# Altium project self_custom_etb_driver.PrjPcb
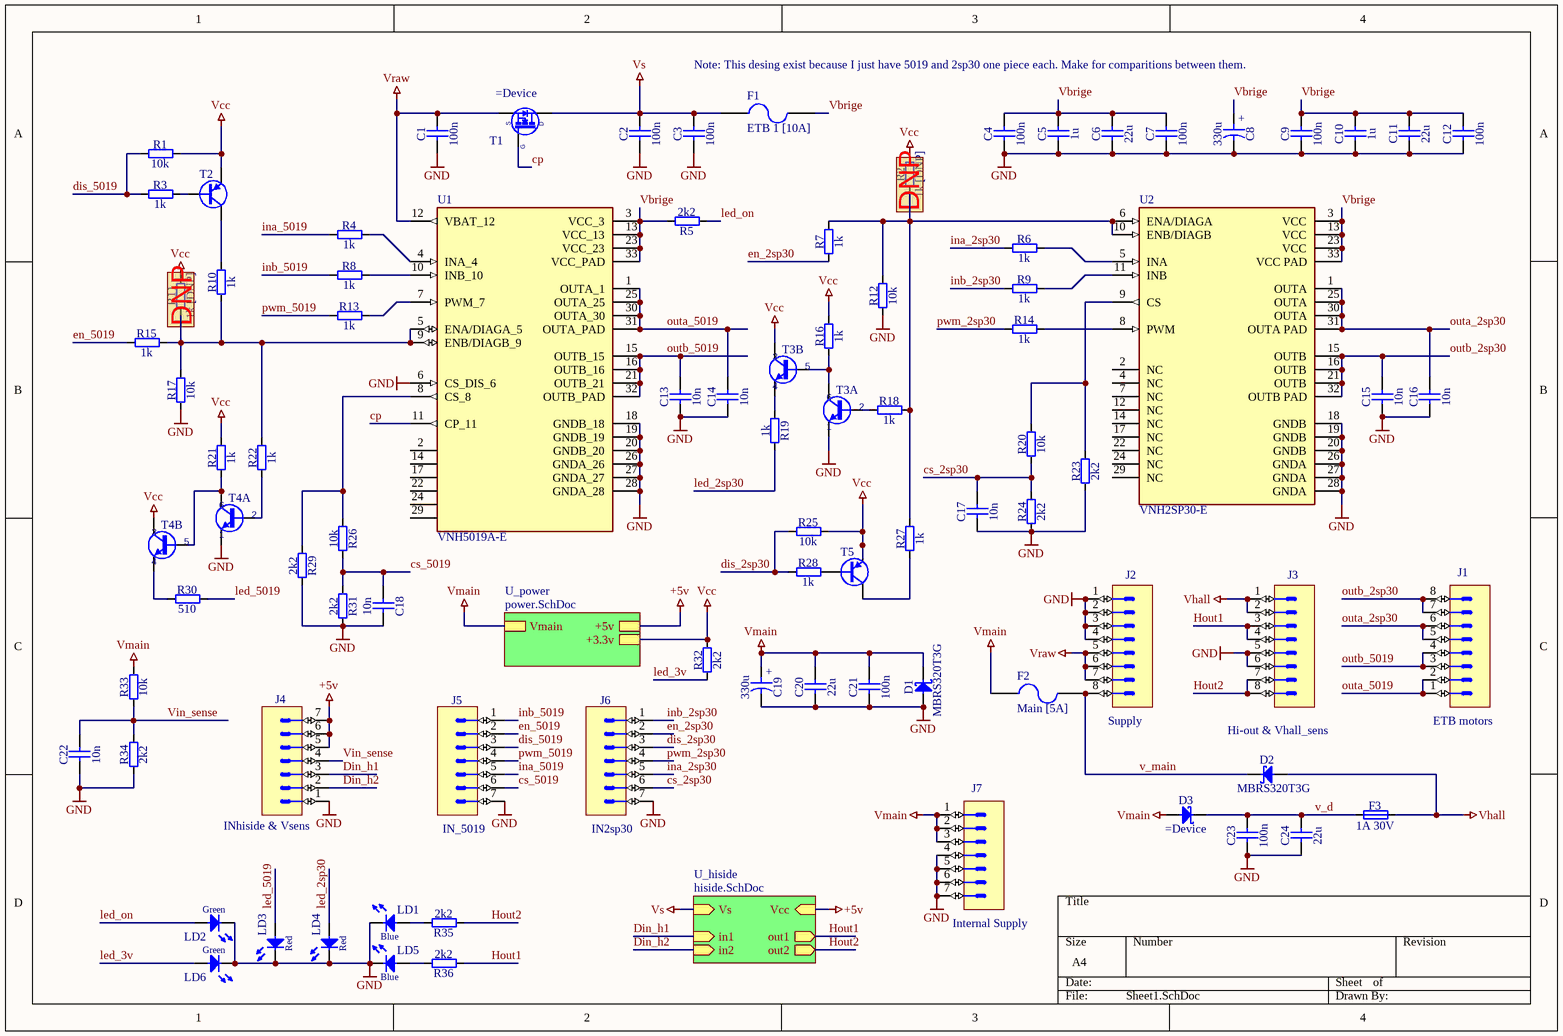
[diagram p0: Sheet1.SchDoc]
3 sheets, 125 parts. Net scope: hierarchical (ports join the sheet entries above them; power ports are global).
Board file: etb_drv.PcbDoc
Sheets:
  Sheet1.SchDoc
    U_power = power.SchDoc
    U_hiside = hiside.SchDoc

## Sheet Sheet1.SchDoc
size A4

### Parts
C1  100n  [CAPC1608X87N]
C2  100n  [CAPC1608X87N]
C3  100n  [CAPC1608X87N]
C4  100n  [CAPC1608X87N]
C5  1u  [CAPC2012X88N]
C6  22u  [CAPC3216X140N]
C7  100n  [CAPC1608X87N]
C8  330u  [CAP AL TH D10 L5 H12.5]
C9  100n  [CAPC1608X87N]
C10  1u  [CAPC2012X88N]
C11  22u  [CAPC3216X140N]
C12  100n  [CAPC1608X87N]
C13  10n  [CAPC1608X87N]
C14  10n  [CAPC1608X87N]
C15  10n  [CAPC1608X87N]
C16  10n  [CAPC1608X87N]
C17  10n  [CAPC1608X87N]
C18  10n  [CAPC1608X87N]
C19  330u  [CAP AL TH D10 L5 H12.5]
C20  22u  [CAPC3216X140N]
C21  100n  [CAPC1608X87N]
C22  10n  [CAPC1608X87N]
C23  100n  [CAPC1608X87N]
C24  22u  [CAPC3216X140N]
D1  MBRS320T3G  [DIOM7659X265N]
D2  MBRS320T3G  [DIOM7659X265N]
D3  (no value)  [SOD123F]
F1  ETB 1 [10A]  [automotive fuse by sd]
F2  Main [5A]  [automotive fuse by sd]
F3  1A 30V  [FUSC_LITTELFUSE_466]
J1  ETB motors  [MOLEX_22-27-2081]
J2  Supply  [MOLEX_22-27-2081]
J3  Hi-out & Vhall_sens  [MOLEX_22-27-2081]
J4  INhiside & Vsens  [MOLEX_22-04-1071]
J5  IN_5019  [MOLEX_22-04-1071]
J6  IN2sp30  [MOLEX_22-04-1071]
J7  Internal Supply  [MOLEX_22-04-1071]
LD1  (no value)  [LED_5MM_YELLOW_1C-2A]
LD2  (no value)  [LED_5MM_GREEN_1C-2A]
LD3  (no value)  [LED_5MM_RED_1C-2A]
LD4  (no value)  [LED_5MM_RED_1C-2A]
LD5  (no value)  [LED_5MM_YELLOW_1C-2A]
LD6  (no value)  [LED_5MM_GREEN_1C-2A]
R1  10k  [RESC1608X55N]
R2  1k [DNP]  [RESC1608X55N]
R3  1k  [RESC1608X55N]
R4  1k  [RESC2013X64N]
R5  2k2  [RESC1608X55N]
R6  1k  [RESC2013X64N]
R7  1k  [RESC1608X55N]
R8  1k  [RESC1608X55N]
R9  1k  [RESC1608X55N]
R10  1k  [RESC1608X55N]
R11  1k [DNP]  [RESC1608X55N]
R12  10k  [RESC1608X55N]
R13  1k  [RESC1608X55N]
R14  1k  [RESC1608X55N]
R15  1k  [RESC1608X55N]
R16  1k  [RESC1608X55N]
R17  10k  [RESC1608X55N]
R18  1k  [RESC1608X55N]
R19  1k  [RESC1608X55N]
R20  10k  [RESC1608X55N]
R21  1k  [RESC1608X55N]
R22  1k  [RESC1608X55N]
R23  2k2  [RESC1608X55N]
R24  2k2  [RESC1608X55N]
R25  10k  [RESC1608X55N]
R26  10k  [RESC1608X55N]
R27  1k  [RESC1608X55N]
R28  1k  [RESC1608X55N]
R29  2k2  [RESC1608X55N]
R30  510  [RESC1608X55N]
R31  2k2  [RESC1608X55N]
R32  2k2  [RESC1608X55N]
R33  10k  [RESC1608X55N]
R34  2k2  [RESC1608X55N]
R35  2k2  [RESC1608X55N]
R36  2k2  [RESC1608X55N]
T1  (no value)  [TO228P991X239-3N-R546X521]
T2  BC857B  [SOT95P230X110-3N]  (value not drawn)
T3  BC847BV  [SOT65P210X110-6N]  (value not drawn)  (parts A,B of 2)
T4  BC847BV  [SOT65P210X110-6N]  (value not drawn)  (parts A,B of 2)
T5  BC857B  [SOT95P230X110-3N]  (value not drawn)
U1  VNH5019A-E  [STMicroelectronics_MultiPowerSO-30_0]
U2  VNH2SP30-E  [STMicroelectronics_MultiPowerSO-30_0]

### Sub-sheets
U_hiside = hiside.SchDoc: in1 (in), in2 (in), out1 (out), out2 (out), Vs (in), Vcc (in)
U_power = power.SchDoc: Vmain, +5v, +3.3v

### Nets
+5v: J4.5 J4.6 J4.7 R1.2 R2.2 R11.2 R16.2 R21.2 R25.2 R32.1 T2.2(E) T3.3(C) T4.3(C) T5.2(E) ; sheet U_power/+5v, sheet U_power/+3.3v, sheet U_hiside/Vcc  [also labelled Vcc]
GND: C1.1 C2.1 C3.1 C4.1 C5.1 C6.1 C7.1 C8.2 C9.1 C10.1 C11.1 C12.1 C13.1 C14.1 C15.1 C16.1 C17.1 C18.1 C19.2 C20.1 C21.1 C22.1 C23.1 C24.1 D1.2(A) J2.1 J2.2 J2.3 J2.4 J3.5 J3.6 J4.1 J5.7 J6.7 J7.4 J7.5 J7.6 J7.7 LD1.1(C) LD2.1(C) LD3.1(C) LD4.1(C) LD5.1(C) LD6.1(C) R12.1 R17.1 R23.1 R24.1 R29.1 R31.1 R34.1 T3.1(E) T4.1(E) U1.6(CS_DIS_6) U1.18(GNDB_18) U1.19(GNDB_19) U1.20(GNDB_20) U1.26(GNDA_26) U1.27(GNDA_27) U1.28(GNDA_28) U2.18(GNDB) U2.19(GNDB) U2.20(GNDB) U2.26(GNDA) U2.27(GNDA) U2.28(GNDA)
Vhall: D2.2(A) F3.2 J3.1 J3.2
Vmain: C19.1 C20.2 C21.2 D1.1(C) D3.2(A) F2.1 J7.1 J7.2 J7.3 R33.2 ; sheet U_power/Vmain
Vraw: C1.2 J2.5 J2.6 J2.7 T1.3(S) U1.12(VBAT_12)
Vs: C2.2 C3.2 F1.2 T1.2(D) ; sheet U_hiside/Vs
cp: T1.1(G) U1.11(CP_11)
cs_2sp30: C17.2 J6.6 R20.1 R24.2
cs_5019: C18.2 J5.6 R26.1 R31.2
Din_h1: J4.3 ; sheet U_hiside/in1
Din_h2: J4.2 ; sheet U_hiside/in2
dis_2sp30: J6.3 R25.1 R28.1
dis_5019: J5.3 R1.1 R3.1
en_2sp30: J6.2 R7.1
en_5019: J5.2 R15.1
Hout1: J3.3 J3.4 R36.2 ; sheet U_hiside/out1
Hout2: J3.7 J3.8 R35.2 ; sheet U_hiside/out2
ina_2sp30: J6.5 R6.1
ina_5019: J5.5 R4.1
inb_2sp30: J6.1 R9.1
inb_5019: J5.1 R8.1
led_2sp30: LD4.2(A) R19.2
led_3v: LD6.2(A) R32.2
led_5019: LD3.2(A) R30.2
led_on: LD2.2(A) R5.2
outa_2sp30: C16.2 J1.5 J1.6 U2.1(OUTA) U2.25(OUTA) U2.30(OUTA) U2.31(OUTA_PAD)
outa_5019: C14.2 J1.1 J1.2 U1.1(OUTA_1) U1.25(OUTA_25) U1.30(OUTA_30) U1.31(OUTA_PAD)
outb_2sp30: C15.2 J1.7 J1.8 U2.15(OUTB) U2.16(OUTB) U2.21(OUTB) U2.32(OUTB_PAD)
outb_5019: C13.2 J1.3 J1.4 U1.15(OUTB_15) U1.16(OUTB_16) U1.21(OUTB_21) U1.32(OUTB_PAD)
pwm_2sp30: J6.4 R14.1
pwm_5019: J5.4 R13.1
v_d: C23.2 C24.2 D3.1(C) F3.1
v_main: D2.1(C) F2.2 J2.8
Vbrige: C4.2 C5.2 C6.2 C7.2 C8.1 C9.2 C10.2 C11.2 C12.2 F1.1 R5.1 U1.3(VCC_3) U1.13(VCC_13) U1.23(VCC_23) U1.33(VCC_PAD) U2.3(VCC) U2.13(VCC) U2.23(VCC) U2.33(VCC_PAD)
Vin_sense: C22.2 J4.4 R33.1 R34.2
NetLD1_2: LD1.2(A) R35.1
NetLD5_2: LD5.2(A) R36.1
NetR2_1: R2.1 R7.2 R12.2 R18.2 R27.2 U2.6(ENA/DIAGA) U2.10(ENB/DIAGB)
NetR3_2: R3.2 T2.1(B)
NetR4_2: R4.2 U1.4(INA_4)
NetR6_2: R6.2 U2.5(INA)
NetR8_2: R8.2 U1.10(INB_10)
NetR9_2: R9.2 U2.11(INB)
NetR10_1: R10.1 R11.1 R15.2 R17.2 R22.2 U1.5(ENA/DIAGA_5) U1.9(ENB/DIAGB_9)
NetR10_2: R10.2 T2.3(C)
NetR13_2: R13.2 U1.7(PWM_7)
NetR14_2: R14.2 U2.8(PWM)
NetR16_1: R16.1 T3.5(B) T3.6(C)
NetR18_1: R18.1 T3.2(B)
NetR19_1: R19.1 T3.4(E)
NetR20_2: R20.2 R23.2 U2.9(CS)
NetR21_1: R21.1 T4.5(B) T4.6(C)
NetR22_1: R22.1 T4.2(B)
NetR26_2: R26.2 R29.2 U1.8(CS_8)
NetR27_1: R27.1 T5.3(C)
NetR28_2: R28.2 T5.1(B)
NetR30_1: R30.1 T4.4(E)

Not connected (* = marked no-connect by the designer): U1 2(N.C._2) 14(NC_14) 17(NC_17) 22(NC_22) 24(NC_24) 29(N.C._29); U2 2(NC) 4(NC) 7(NC) 12(NC) 14(NC) 17(NC) 22(NC) 24(NC) 29(NC)

### Notes on the sheet
- Note: This desing exist because I just have 5019 and 2sp30 one piece each. Make for comparitions between them.
- (near R2) DNP
- (near R11) DNP
- (in symbol Capacitor - polarized) +
- (in symbol LED Blue 1C 2A) Blue
- (in symbol LED Green 1C 2A) Green
- (in symbol LED Red 1C 2A) Red

### Library data of the parts
C1-C7 C9-C18 C20-C24 = Capacitor - non polarized: Non-polarised capacitor
  C1-C4 C7 C9 C12 C21 C23: Value: 100n
  C5 C10: Value: 1u
  C6 C11 C20 C24: Value: 22u
  C13-C18 C22: Value: 10n
C8 C19 = Capacitor - polarized: Polarised capacitor; Value: 330u
D1-D3 = Diode Schottky: Schottky Diode
  D1 D2: Device: MBRS320T3G
F1 F2 = Fuse 2: Fuse; Published: 8-Jun-2000; LatestRevisionDate: 17-Jul-2002; LatestRevisionNote: Re-released for DXP Platform.; PackageReference: PIN-W2/E2.8; Publisher: Altium Limited; PackageDescription: Thru-Hole; 2 Leads
F3 = Fuse: Value: 1A 30V
J1-J3 = Connector 8 Male
J4-J7 = Connector 7 Male
LD1 LD5 = LED Blue 1C 2A
LD2 LD6 = LED Green 1C 2A
LD3 LD4 = LED Red 1C 2A
R1-R36 = Resistor
  R1 R12 R17 R20 R25 R26 R33: Value: 10k
  R2 R11: Value: 1k [DNP]
  R3 R4 R6-R10 R13-R16 R18 R19 R21 R22 R27 R28: Value: 1k
  R5 R23 R24 R29 R31 R32 R34-R36: Value: 2k2
  R30: Value: 510
T1 = N-MOSFET-D 1G 2D 3S: N-CHANNEL MOSFET WITH DIODE
T2 T5 = BC857B: PNP Transistor; Part Description: 45V 100mA PNP general-purpose transistors; Manufacturer: NXP SEMICONDUCTORS; Table: Transistors; Part Number: BC857B; Component Kind: Standard; Component Type: Standard; Device: BC857B; PackageDescription: SOT23, 3 pin, Pitch 0.95mm - 1.3mm W X 2.9mm L X 1.1mm H, IPC Medium Density; Manufacturer Part Number: BC857B; Pin Count: 3; Case: SOT23-3; Mounted: Yes; Socket: No; SMD: Yes; ComponentHeight: 1.1mm; HelpURL: \\cern.ch\dfs\Applications\Altium\Datasheets\BC857B.pdf; Author: CERN DEM JLC; CreateDate: 14.06.2011; LatestRevisionDate: 14.06.2011
T3 T4 = BC847BV: 45V, 100mA NPN General Purpose Double Transistor; Part Description: 45V 100mA NPN General Purpose Double Transistor; Manufacturer: NXP SEMICONDUCTORS; Table: Transistors; Part Number: BC847BV; Component Kind: Standard; Component Type: Standard; Device: BC847BV; Footprint: SOTFL50P160X60-6N; PackageDescription: SOTFL (SOT666), 0.50mm, Pitch; 6 Pin, 1.20mm W X 1.60mm L X 0.60mm H Body, IPC Medium Density; Manufacturer Part Number: BC847BV; Pin Count: 6; Case: SOT666; Mounted: Yes; Socket: No; SMD: Yes; ComponentHeight: 0.6mm; HelpURL: \\cern.ch\dfs\Applications\Altium\Datasheets\BC847BV.pdf; Author: CERN DEM JLC; CreateDate: 01.12.2011; LatestRevisionDate: 01.12.2011
U1 = VNH5019A-E: Motor Driver Power MOSFET Parallel, PWM MultiPowerSO-30; MF: STMicroelectronics; Value: *; Availability: Unavailable; MP: VNH5019A-E; Price: None; Package: PowerSOP-30 STMicroelectronics; SnapEDA_Link: https://www.snapeda.com/parts/VNH5019A-E/STMicroelectronics/view-part/231156/?ref=snap
U2 = VNH2SP30-E: IC MOTOR DRIVER PAR 30MULTIPWRSO; Manufacturer: STMicroelectronics; Voltage: 16V; Mfg Package Ident: MultiPowerSO-30; helpURL: https://upverter.com/upn/revision/311e1642ff6559a6/; ComponentLink2Description: Datasheet; Temperature: -40°C to +150°C; Package: MultiPowerSO-30; Supplier 2: Mouser; Supplier 1: Digi-Key; ComponentLink1URL: https://upverter.com/upn/revision/311e1642ff6559a6/; Supplier Part Number 2: 511-VNH2SP30-E; Supplier Part Number 1: 497-4500-5-ND; ComponentLink1Description: Upverter; ComponentLink2URL: http://www.st.com/content/ccc/resource/technical/document/datasheet/group2/66/b8/f5/2c/9a/66/41/c7/CD00043711/files/CD00043711.pdf/jcr:content/translations/en.CD00043711.pdf; RoHS: TRUE; Mouser Part Number: 511-VNH2SP30-E; Temperature Range High: +150°C; Digikey Description: IC MOTOR DRIVER PAR 30MULTIPWRSO; Digikey Part Number: 497-4500-5-ND; Lead Free: yes; Temperature Range Low: -40°C

## Sheet power.SchDoc
size A4
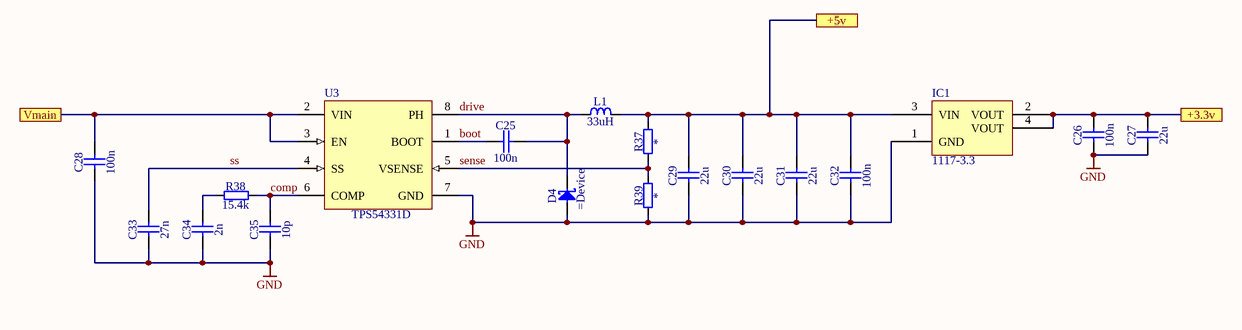
[diagram p1: power.SchDoc]

### Parts
C25  100n  [CAPC1608X87N]
C26  100n  [CAPC1608X87N]
C27  22u  [CAPC3216X140N]
C28  100n  [CAPC1608X87N]
C29  22u  [CAPC3216X140N]
C30  22u  [CAPC3216X140N]
C31  22u  [CAPC3216X140N]
C32  100n  [CAPC1608X87N]
C33  27n  [CAPC1608X87N]
C34  2n  [CAPC1608X87N]
C35  10p  [CAPC1608X87N]
D4  (no value)  [DIOM7659X265N]
IC1  1117-3.3  [SOT230P700X180-4N]
L1  33uH  [IND_WURTH_WE-PD_7332(METAL)]
R37  *  [RESC1608X55N]
R38  15.4k  [RESC1608X55N]
R39  *  [RESC1608X55N]
U3  TPS54331D  [SOIC127P600X175-8N]

### Ports
+3.3v, +5v, Vmain

### Nets
+5v: C26.2 C27.2 C29.2 C30.2 C31.2 C32.2 IC1.2(VOUT) IC1.3(VIN) IC1.4(VOUT) L1.2 R37.2 ; port +5v, port +3.3v
GND: C26.1 C27.1 C28.1 C29.1 C30.1 C31.1 C32.1 C33.1 C34.1 C35.1 D4.2(A) IC1.1(GND) R39.1 U3.7(GND)
Vmain: C28.2 U3.2(VIN) U3.3(EN) ; port Vmain
boot: C25.1 U3.1(BOOT)
comp: C35.2 R38.2 U3.6(COMP)
drive: C25.2 D4.1(C) L1.1 U3.8(PH)
sense: R37.1 R39.2 U3.5(VSENSE)
ss: C33.2 U3.4(SS)
NetC34_2: C34.2 R38.1

### Library data of the parts
C25-C35 = Capacitor - non polarized: Non-polarised capacitor
  C25 C26 C28 C32: Value: 100n
  C27 C29-C31: Value: 22u
  C33: Value: 27n
  C34: Value: 2n
  C35: Value: 10p
D4 = Diode Schottky: Schottky Diode
IC1 = ON Semi NCP1117: 1.0A Low-Dropout Positive Fixed and Adjustable Voltage Regulators
L1 = Inductor: Device: HPI0630-330; Value: 33uH
R37-R39 = Resistor
  R37 R39: Value: *
  R38: Value: 15.4k
U3 = TPS54331D: Buck Step Down Regulator with 3.5 to 28 V Input and 0.8 to 25 V Output, -40 to 150 degC, 8-Pin SOIC (D), Green (RoHS & no Sb/Br); Manufacturer: Texas Instruments; Vout(Min)(V): 0.8; Vin(Min)(V): 3.5; Duty Cycle(Max)(%): 90; SubFamily: Step-Down Regulator; Iq(Typ)(mA): 0.11; Vin(Max)(V): 28; Rating: Catalog; Vout(Max)(V): 25; Iout(Max)(A): 3; Regulated Outputs(#): 1; PackageReference: D8; Switch Current Limit(Typ)(A): 3.5; Topology: Buck; Eco-Plan: Green (RoHS & no Sb/Br); PartNumber: TPS54331D; ComponentLink1Description: Datasheet; ComponentLink2Description: Package Specification; DatasheetVersion: SLVS839D; ComponentLink3URL: Samples URL:http://www.ti.com/product/tps54331#samples; ComponentLink1URL: http://www.ti.com/general/docs/lit/getliterature.tsp?genericPartNumber=TPS54331&fileType=pdf; Code_JEDEC: MS-012AA; ComponentLink2URL: http://www.ti.com/litv/pdf/msoi002j; ComponentLink3Description: URL Link1; PackageVersion: revM, Jun-2011; Mounting Technology: Surface Mount; PackageDescription: 8-Pin Plastic Small Outline Integrated Circuit, 4.9 x 3.9 mm, Pitch 1.27 mm Pitch

## Sheet hiside.SchDoc
size A4
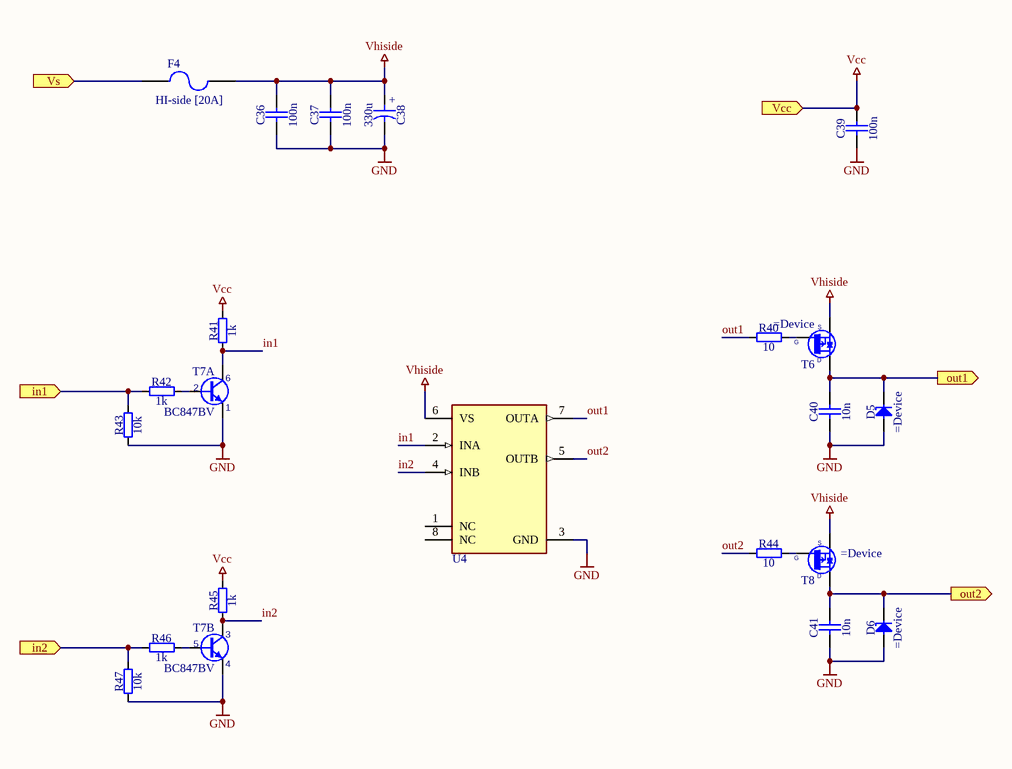
[diagram p2: hiside.SchDoc]

### Parts
C36  100n  [CAP 1206/3216 - 0.8MM]
C37  100n  [CAP 1206/3216 - 0.8MM]
C38  330u  [CAP AL TH D10 L5 H12.5]
C39  100n  [CAPC1608X87N]
C40  10n  [CAPC1608X87N]
C41  10n  [CAPC1608X87N]
D5  (no value)  [DIOM7659X265N]
D6  (no value)  [DIOM7659X265N]
F4  HI-side [20A]  [automotive fuse by sd]
R40  10  [RESC2012X60N]
R41  1k  [RESC1608X55N]
R42  1k  [RESC1608X55N]
R43  10k  [RESC1608X55N]
R44  10  [RESC2012X60N]
R45  1k  [RESC1608X55N]
R46  1k  [RESC1608X55N]
R47  10k  [RESC1608X55N]
T6  (no value)  [TO228P991X239-3N-R546X521]
T7  BC847BV  [SOT65P210X110-6N]  (parts A,B of 2)
T8  (no value)  [TO228P991X239-3N-R546X521]
U4  IR4427STRPBF  [SOIC127P600X175-8N]  (value not drawn)

### Ports
in1 (in), in2 (in), out1 (out), out2 (out), Vcc (in), Vs (in)

### Nets
GND: C36.1 C37.1 C38.2 C39.1 C40.1 C41.1 D5.2(A) D6.2(A) R43.1 R47.1 T7.1(E) T7.4(E) U4.3(GND)
Vcc: C39.2 R41.2 R45.2 ; port Vcc  [project net +5v]
Vhiside: C36.2 C37.2 C38.1 F4.2 T6.3(S) T8.3(S) U4.6(VS)
Vs: F4.1 ; port Vs
Din_h1: R42.1 R43.2 ; port in1
Din_h2: R46.1 R47.2 ; port in2
Hout1: C40.2 D5.1(C) T6.1(D) ; port out1
Hout2: C41.2 D6.1(C) T8.1(D) ; port out2
in1: R41.1 T7.6(C) U4.2(INA)
in2: R45.1 T7.3(C) U4.4(INB)
out1: R40.1 U4.7(OUTA)
out2: R44.1 U4.5(OUTB)
NetR40_2: R40.2 T6.2(G)
NetR42_2: R42.2 T7.2(B)
NetR44_2: R44.2 T8.2(G)
NetR46_2: R46.2 T7.5(B)

Not connected (* = marked no-connect by the designer): U4 1(NC) 8(NC)

### Notes on the sheet
- (in symbol Capacitor - polarized) +

### Library data of the parts
C36 C37 C39-C41 = Capacitor - non polarized: Non-polarised capacitor
  C36 C37 C39: Value: 100n
  C40 C41: Value: 10n
C38 = Capacitor - polarized: Polarised capacitor; Value: 330u
D5 D6 = Diode ESD: ESD protection diode
F4 = Fuse 2: Fuse; Published: 8-Jun-2000; LatestRevisionDate: 17-Jul-2002; LatestRevisionNote: Re-released for DXP Platform.; PackageReference: PIN-W2/E2.8; Publisher: Altium Limited; PackageDescription: Thru-Hole; 2 Leads
R40-R47 = Resistor
  R40 R44: Value: 10
  R41 R42 R45 R46: Value: 1k
  R43 R47: Value: 10k
T6 T8 = P-MOSFET-D 1D 2G 3S: P-CHANNEL MOSFET WITH DIODE
T7 = BC847BV: 45V, 100mA NPN General Purpose Double Transistor; Device: BC847BV

## Nets that join several sheets
+5v: Sheet1 (14 pins), power (11 pins), hiside (C39.2 R41.2 R45.2)
GND: Sheet1 (66 pins), power (14 pins), hiside (13 pins)
Vmain: Sheet1 (10 pins), power (C28.2 U3.2 U3.3)
Vs: Sheet1 (C2.2 C3.2 F1.2 T1.2), hiside (F4.1)
Din_h1: Sheet1 (J4.3), hiside (R42.1 R43.2)
Din_h2: Sheet1 (J4.2), hiside (R46.1 R47.2)
Hout1: Sheet1 (J3.3 J3.4 R36.2), hiside (C40.2 D5.1 T6.1)
Hout2: Sheet1 (J3.7 J3.8 R35.2), hiside (C41.2 D6.1 T8.1)